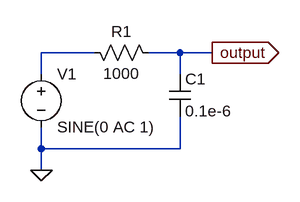
[diagram p0: schematic rc_filter.asc]
rc_filter.asc, the LTspice schematic file:
Version 4
SHEET 1 880 680
WIRE 176 96 96 96
WIRE 304 96 256 96
WIRE 352 96 304 96
WIRE 96 128 96 96
WIRE 304 128 304 96
WIRE 96 240 96 208
WIRE 304 240 304 192
WIRE 304 240 96 240
WIRE 96 272 96 240
FLAG 96 272 0
FLAG 352 96 output
IOPIN 352 96 Out
SYMBOL voltage 96 112 R0
WINDOW 123 0 0 Left 0
WINDOW 39 0 0 Left 0
SYMATTR InstName V1
SYMATTR Value SINE(0 AC 1)
SYMBOL res 160 80 M90
WINDOW 0 0 56 VBottom 2
WINDOW 3 32 56 VTop 2
SYMATTR InstName R1
SYMATTR Value 1000
SYMBOL cap 288 128 R0
SYMATTR InstName C1
SYMATTR Value 0.1e-6

The netlist it stands for:
* rc_filter.asc
V1 N001 0 SINE(0 AC 1)
R1 N001 output 1000
C1 output 0 0.1e-6
.backanno
.end